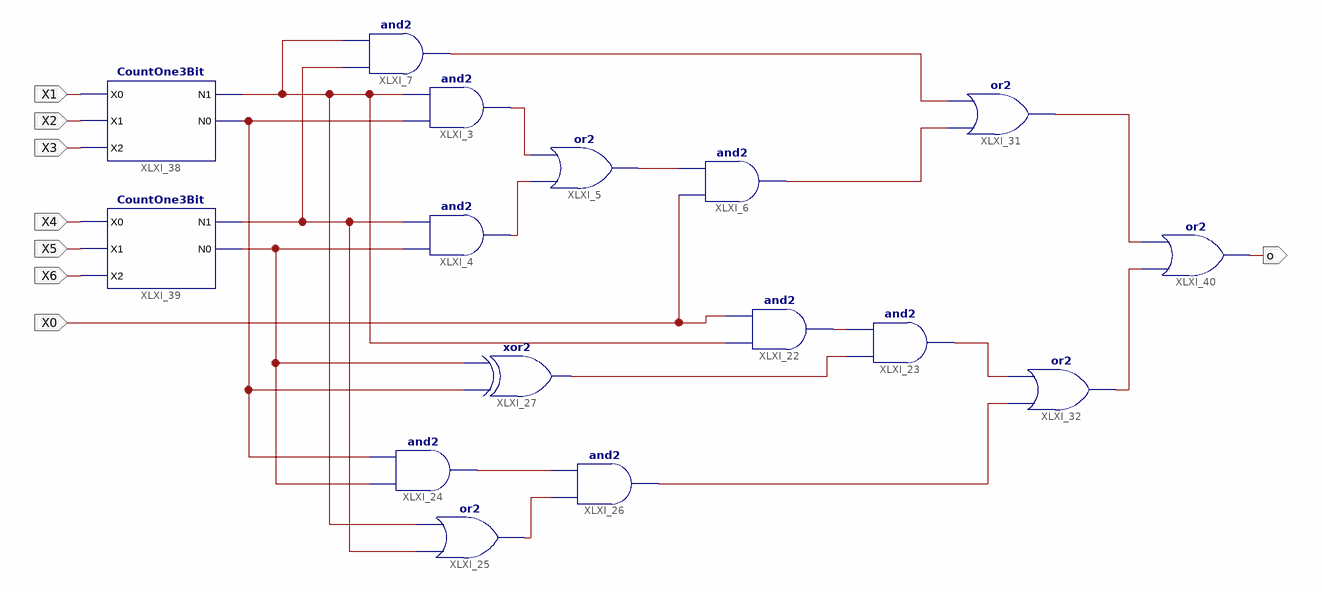
[diagram p0: schematic sheet 1]
// Xilinx ISE schematic Majority_Circuit.sch (spartan3a) as structural Verilog: 16 symbols, 8 ports
module Majority_Circuit (
  input  X1,
  input  X2,
  input  X3,
  input  X5,
  input  X4,
  input  X6,
  input  X0,
  output o
);

  wire XLXN_8, XLXN_9, XLXN_10, XLXN_12, XLXN_14, XLXN_15, XLXN_17, XLXN_33, XLXN_35, XLXN_37, XLXN_38,
       XLXN_45, XLXN_46, XLXN_47, XLXN_48, XLXN_49, XLXN_50;

  and XLXI_7 (XLXN_48, XLXN_10, XLXN_8);
  and XLXI_6 (XLXN_49, X0, XLXN_17);
  or XLXI_5 (XLXN_17, XLXN_15, XLXN_14);
  and XLXI_4 (XLXN_15, XLXN_12, XLXN_10);
  and XLXI_3 (XLXN_14, XLXN_9, XLXN_8);
  and XLXI_22 (XLXN_33, XLXN_8, X0);
  and XLXI_23 (XLXN_45, XLXN_35, XLXN_33);
  xor XLXI_27 (XLXN_35, XLXN_9, XLXN_12);
  and XLXI_24 (XLXN_37, XLXN_12, XLXN_9);
  or XLXI_25 (XLXN_38, XLXN_10, XLXN_8);
  and XLXI_26 (XLXN_46, XLXN_38, XLXN_37);
  or XLXI_31 (XLXN_50, XLXN_49, XLXN_48);
  or XLXI_32 (XLXN_47, XLXN_46, XLXN_45);
  CountOne3Bit XLXI_38 (.N0(XLXN_9), .N1(XLXN_8), .X0(X1), .X1(X2), .X2(X3));
  CountOne3Bit XLXI_39 (.N0(XLXN_12), .N1(XLXN_10), .X0(X4), .X1(X5), .X2(X6));
  or XLXI_40 (o, XLXN_47, XLXN_50);
endmodule
